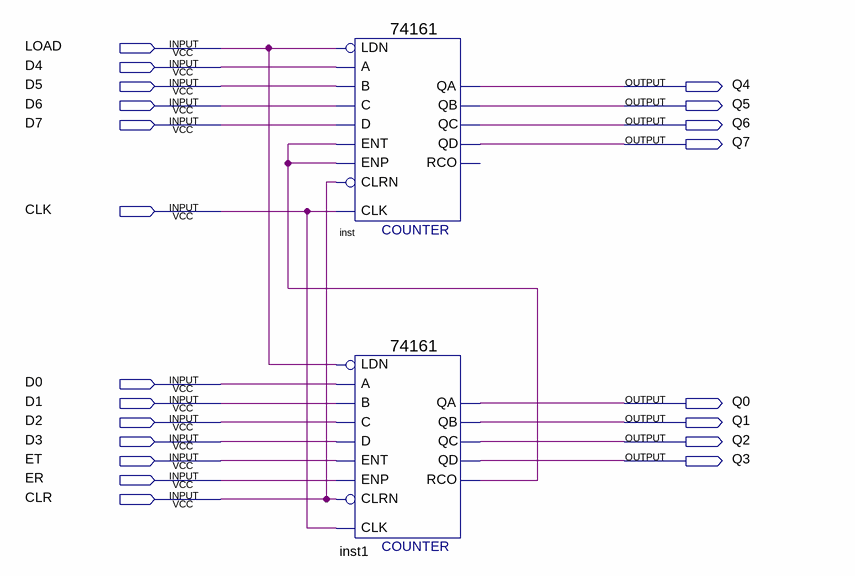
[diagram p0: schematic sheet]
// Quartus schematic upc.bdf as structural Verilog: 2 symbols, 21 pins
module upc (
  input  LOAD,
  input  D4,
  input  D5,
  input  D6,
  input  D7,
  input  CLK,
  input  D0,
  input  D1,
  input  D2,
  input  D3,
  input  ET,
  input  ER,
  input  CLR,
  output Q4,
  output Q5,
  output Q6,
  output Q7,
  output Q0,
  output Q1,
  output Q2,
  output Q3
);

  wire inst1_rco;

  \74161  inst (
    .CLRN(CLR), .CLK(CLK), .ENP(inst1_rco), .LDN(LOAD), .A(D4), .D(D7), .ENT(inst1_rco), .B(D5), .C(D6),
    .QD(Q7), .QC(Q6), .QB(Q5), .QA(Q4));  // open: RCO
  \74161  inst1 (
    .CLRN(CLR), .CLK(CLK), .ENP(ER), .LDN(LOAD), .A(D0), .D(D3), .ENT(ET), .B(D1), .C(D2), .QD(Q3), .QC(Q2),
    .QB(Q1), .QA(Q0), .RCO(inst1_rco));
endmodule
